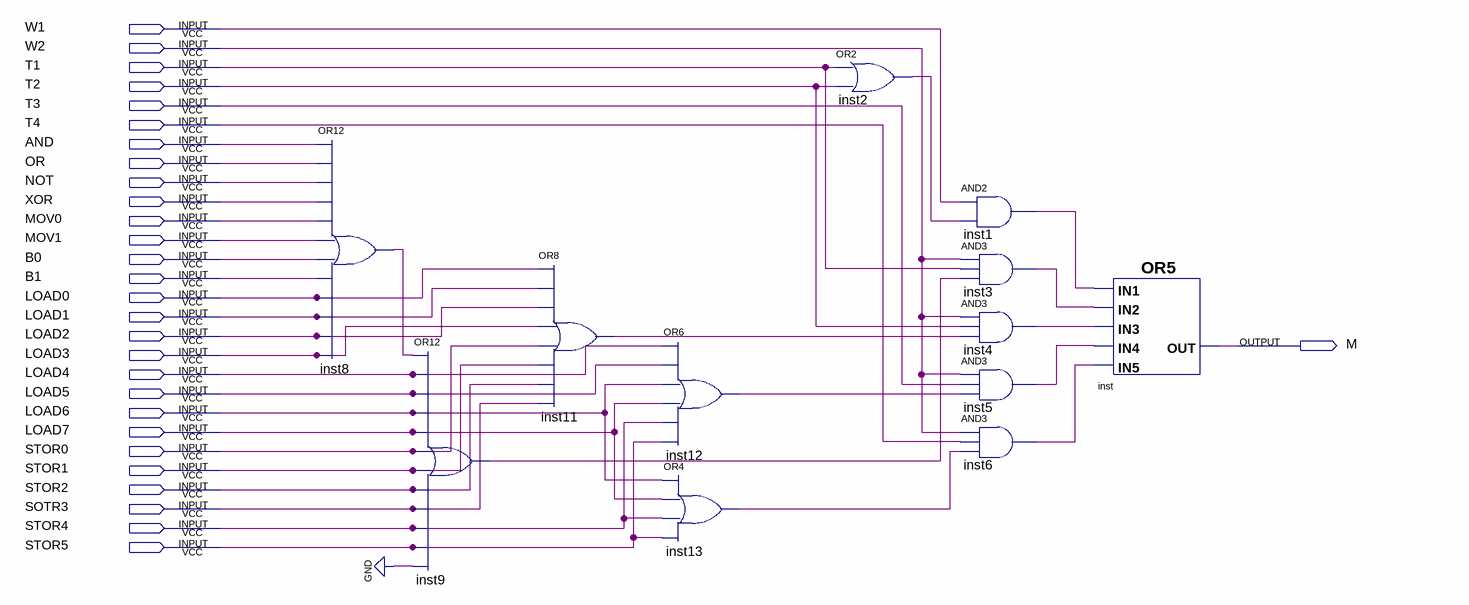
[diagram p0: schematic sheet]
// Quartus schematic M.bdf as structural Verilog: 12 symbols, 29 pins
module M (
  input  W1,
  input  W2,
  input  T1,
  input  T2,
  input  T3,
  input  T4,
  input  AND,
  input  OR,
  input  NOT,
  input  XOR,
  input  MOV0,
  input  MOV1,
  input  B0,
  input  B1,
  input  LOAD0,
  input  LOAD1,
  input  LOAD2,
  input  LOAD3,
  input  LOAD4,
  input  LOAD5,
  input  LOAD6,
  input  LOAD7,
  input  STOR0,
  input  STOR1,
  input  STOR2,
  input  SOTR3,
  input  STOR4,
  input  STOR5,
  output M
);

  wire inst1_out, inst2_out, inst3_out, inst4_out, inst5_out, inst6_out, inst8_out, inst9_out, inst11_out,
       inst12_out, inst13_out;

  or inst8 (inst8_out, AND, OR, NOT, XOR, MOV0, MOV1, B0, B1, LOAD0, LOAD1, LOAD2, LOAD3);
  or inst9 (inst9_out, inst8_out, LOAD4, LOAD5, LOAD6, LOAD7, STOR0, STOR1, STOR2, SOTR3, STOR4, STOR5, 1'b0);
  or inst11 (inst11_out, LOAD0, LOAD1, LOAD2, LOAD3, STOR0, STOR1, STOR2, SOTR3);
  or inst12 (inst12_out, LOAD4, LOAD5, LOAD6, LOAD7, STOR4, STOR5);
  or inst13 (inst13_out, LOAD6, LOAD7, STOR4, STOR5);
  or inst2 (inst2_out, T1, T2);
  and inst1 (inst1_out, W1, inst2_out);
  and inst3 (inst3_out, W2, T1, inst9_out);
  and inst4 (inst4_out, W2, T2, inst11_out);
  and inst5 (inst5_out, W2, T3, inst12_out);
  and inst6 (inst6_out, W2, T4, inst13_out);
  or inst (M, inst1_out, inst3_out, inst4_out, inst5_out, inst6_out);
endmodule
